# Altium project ife19_TS_BMS_v2.PrjPCB
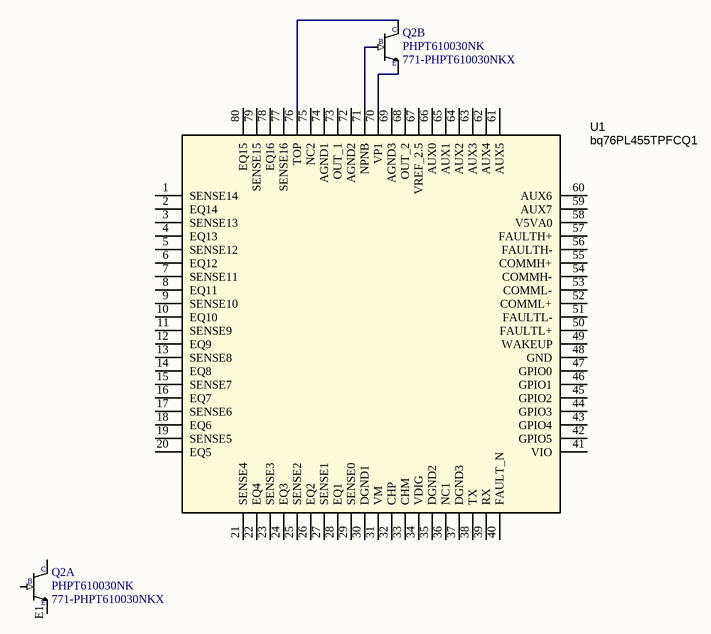
[diagram p0: ife19_TS_BMS_v2.SchDoc]
1 sheet, 2 parts. Net scope: global (net labels, ports and power ports of the same name join across sheets).
Board file: ife19_TS_BMS_v2.PcbDoc

## Sheet ife19_TS_BMS_v2.SchDoc
size A

### Parts
Q2  PHPT610030NK  Supplier Part Number 1: 771-PHPT610030NKX  [LFPAK-56-8]  (parts A,B of 2)
U1  bq76PL455TPFCQ1  [455D-socket]

### Nets
NetQ2_B2: Q2.B2 U1.71(NPNB)
NetQ2_C2: Q2.C2 U1.76(TOP)
NetQ2_E2: Q2.E2 U1.70(VP1)

Not connected (* = marked no-connect by the designer): Q2 B1 C1 E1; U1 1(SENSE14) 2(EQ14) 3(SENSE13) 4(EQ13) 5(SENSE12) 6(EQ12) 7(SENSE11) 8(EQ11) 9(SENSE10) 10(EQ10) 11(SENSE9) 12(EQ9) 13(SENSE8) 14(EQ8) 15(SENSE7) 16(EQ7) 17(SENSE6) 18(EQ6) 19(SENSE5) 20(EQ5) 21(SENSE4) 22(EQ4) 23(SENSE3) 24(EQ3) 25(SENSE2) 26(EQ2) 27(SENSE1) 28(EQ1) 29(SENSE0) 30(DGND1) 31(VM) 32(CHP) 33(CHM) 34(VDIG) 35(DGND2) 36(NC1) 37(DGND3) 38(TX) 39(RX) 40(FAULT_N) 41(VIO) 42(GPIO5) 43(GPIO4) 44(GPIO3) 45(GPIO2) 46(GPIO1) 47(GPIO0) 48(GND) 49(WAKEUP) 50(FAULTL+) 51(FAULTL-) 52(COMML+) 53(COMML-) 54(COMMH-) 55(COMMH+) 56(FAULTH-) 57(FAULTH+) 58(V5VA0) 59(AUX7) 60(AUX6) 61(AUX5) 62(AUX4) 63(AUX3) 64(AUX2) 65(AUX1) 66(AUX0) 67(VREF_2.5) 68(OUT_2) 69(AGND3) 72(AGND2) 73(OUT_1) 74(AGND1) 75(NC2) 77(SENSE16) 78(EQ16) 79(SENSE15) 80(EQ15)

### Notes on the sheet
- (in symbol PHPT610030NK, part A) C; B; E
- (in symbol PHPT610030NK, part B) C; B; E

### Library data of the parts
Q2 = PHPT610030NK: Dual BJT 100V, 3A, hfe>250 / Nexperia; CompType: Used in BOM Report; Manufacturer: Nexperia; MountingType: SMT; MouserPartNumber: PHPT610030NKX; Supplier 1: Mouser
U1 = bq76PL455: 16 Cell Battery Stack Monitor with Passive Cell Balancing; Manufacturer: Texas Instruments; CompType: Used in BOM report; SymbolVersion: use current date i.e. 2008-05-20; SymbolCreator: Use LDAP id; MountType: SMT; RoHS: Y; PartNumber: bq76PL455TPFCQ1; PackageReference: VHB80A; ComponentLink1Description: Datasheet Link